# EAGLE schematic MotorAndMotorController (EAGLE 9.5.1)
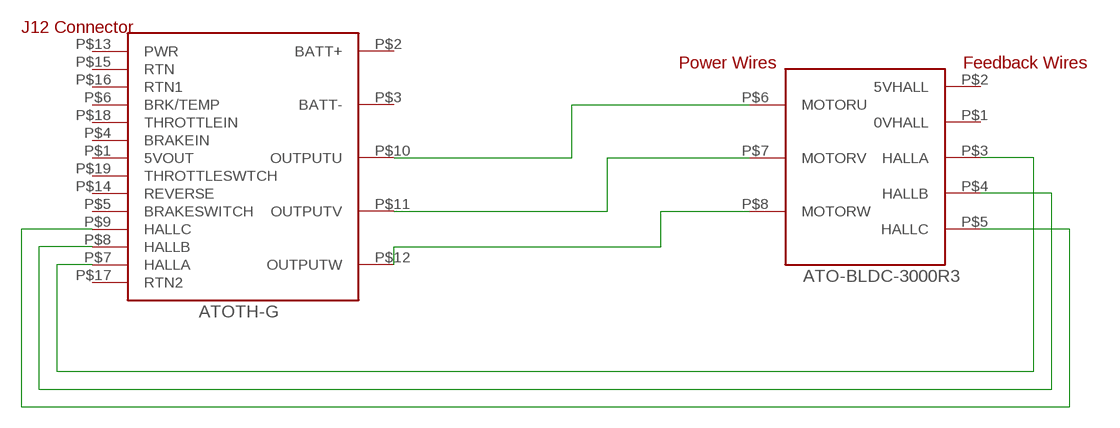
[diagram p0: schematic, sheet 1]

## Parts
U$1  ATO-BLDC-3000R3  [ATO-BLDC-3000R3]
U$2  ATOTH-GCONTROLLER  [ATOTH-GCONTROLLER]

## Nets
N$1: U$1.P$6(MOTORU) U$2.P$10(OUTPUTU)
N$2: U$1.P$7(MOTORV) U$2.P$11(OUTPUTV)
N$3: U$1.P$8(MOTORW) U$2.P$12(OUTPUTW)
N$4: U$1.P$3(HALLA) U$2.P$7(HALLA)
N$5: U$1.P$4(HALLB) U$2.P$8(HALLB)
N$6: U$1.P$5(HALLC) U$2.P$9(HALLC)
Unconnected: U$1.P$1(0VHALL) U$1.P$2(5VHALL) U$2.P$1(5VOUT) U$2.P$2(BATT+) U$2.P$3(BATT-) U$2.P$4(BRAKEIN) U$2.P$5(BRAKESWITCH) U$2.P$6(BRK/TEMP) U$2.P$13(PWR) U$2.P$14(REVERSE) U$2.P$15(RTN) U$2.P$16(RTN1) U$2.P$17(RTN2) U$2.P$18(THROTTLEIN) U$2.P$19(THROTTLESWTCH)

## Library data of the parts
U$1 = SolarCarMotors:ATO-BLDC-3000R3
U$2 = SolarCarMotors:ATOTH-GCONTROLLER

## Module MOTORCONTROL
Ports: 

### Library data of the parts